# EasyEDA Pro project pcb_main.epro

# Schematic Schematic1
Board Name: Board3; Create Date: 2026-03-30; Page Name: P1; Project Name: DPE25-26-2PCB; Schematic Name: Schematic1; Update Date: 2026-04-02; Company: EasyEDA.com; Page Size: A4; Version: V1.0
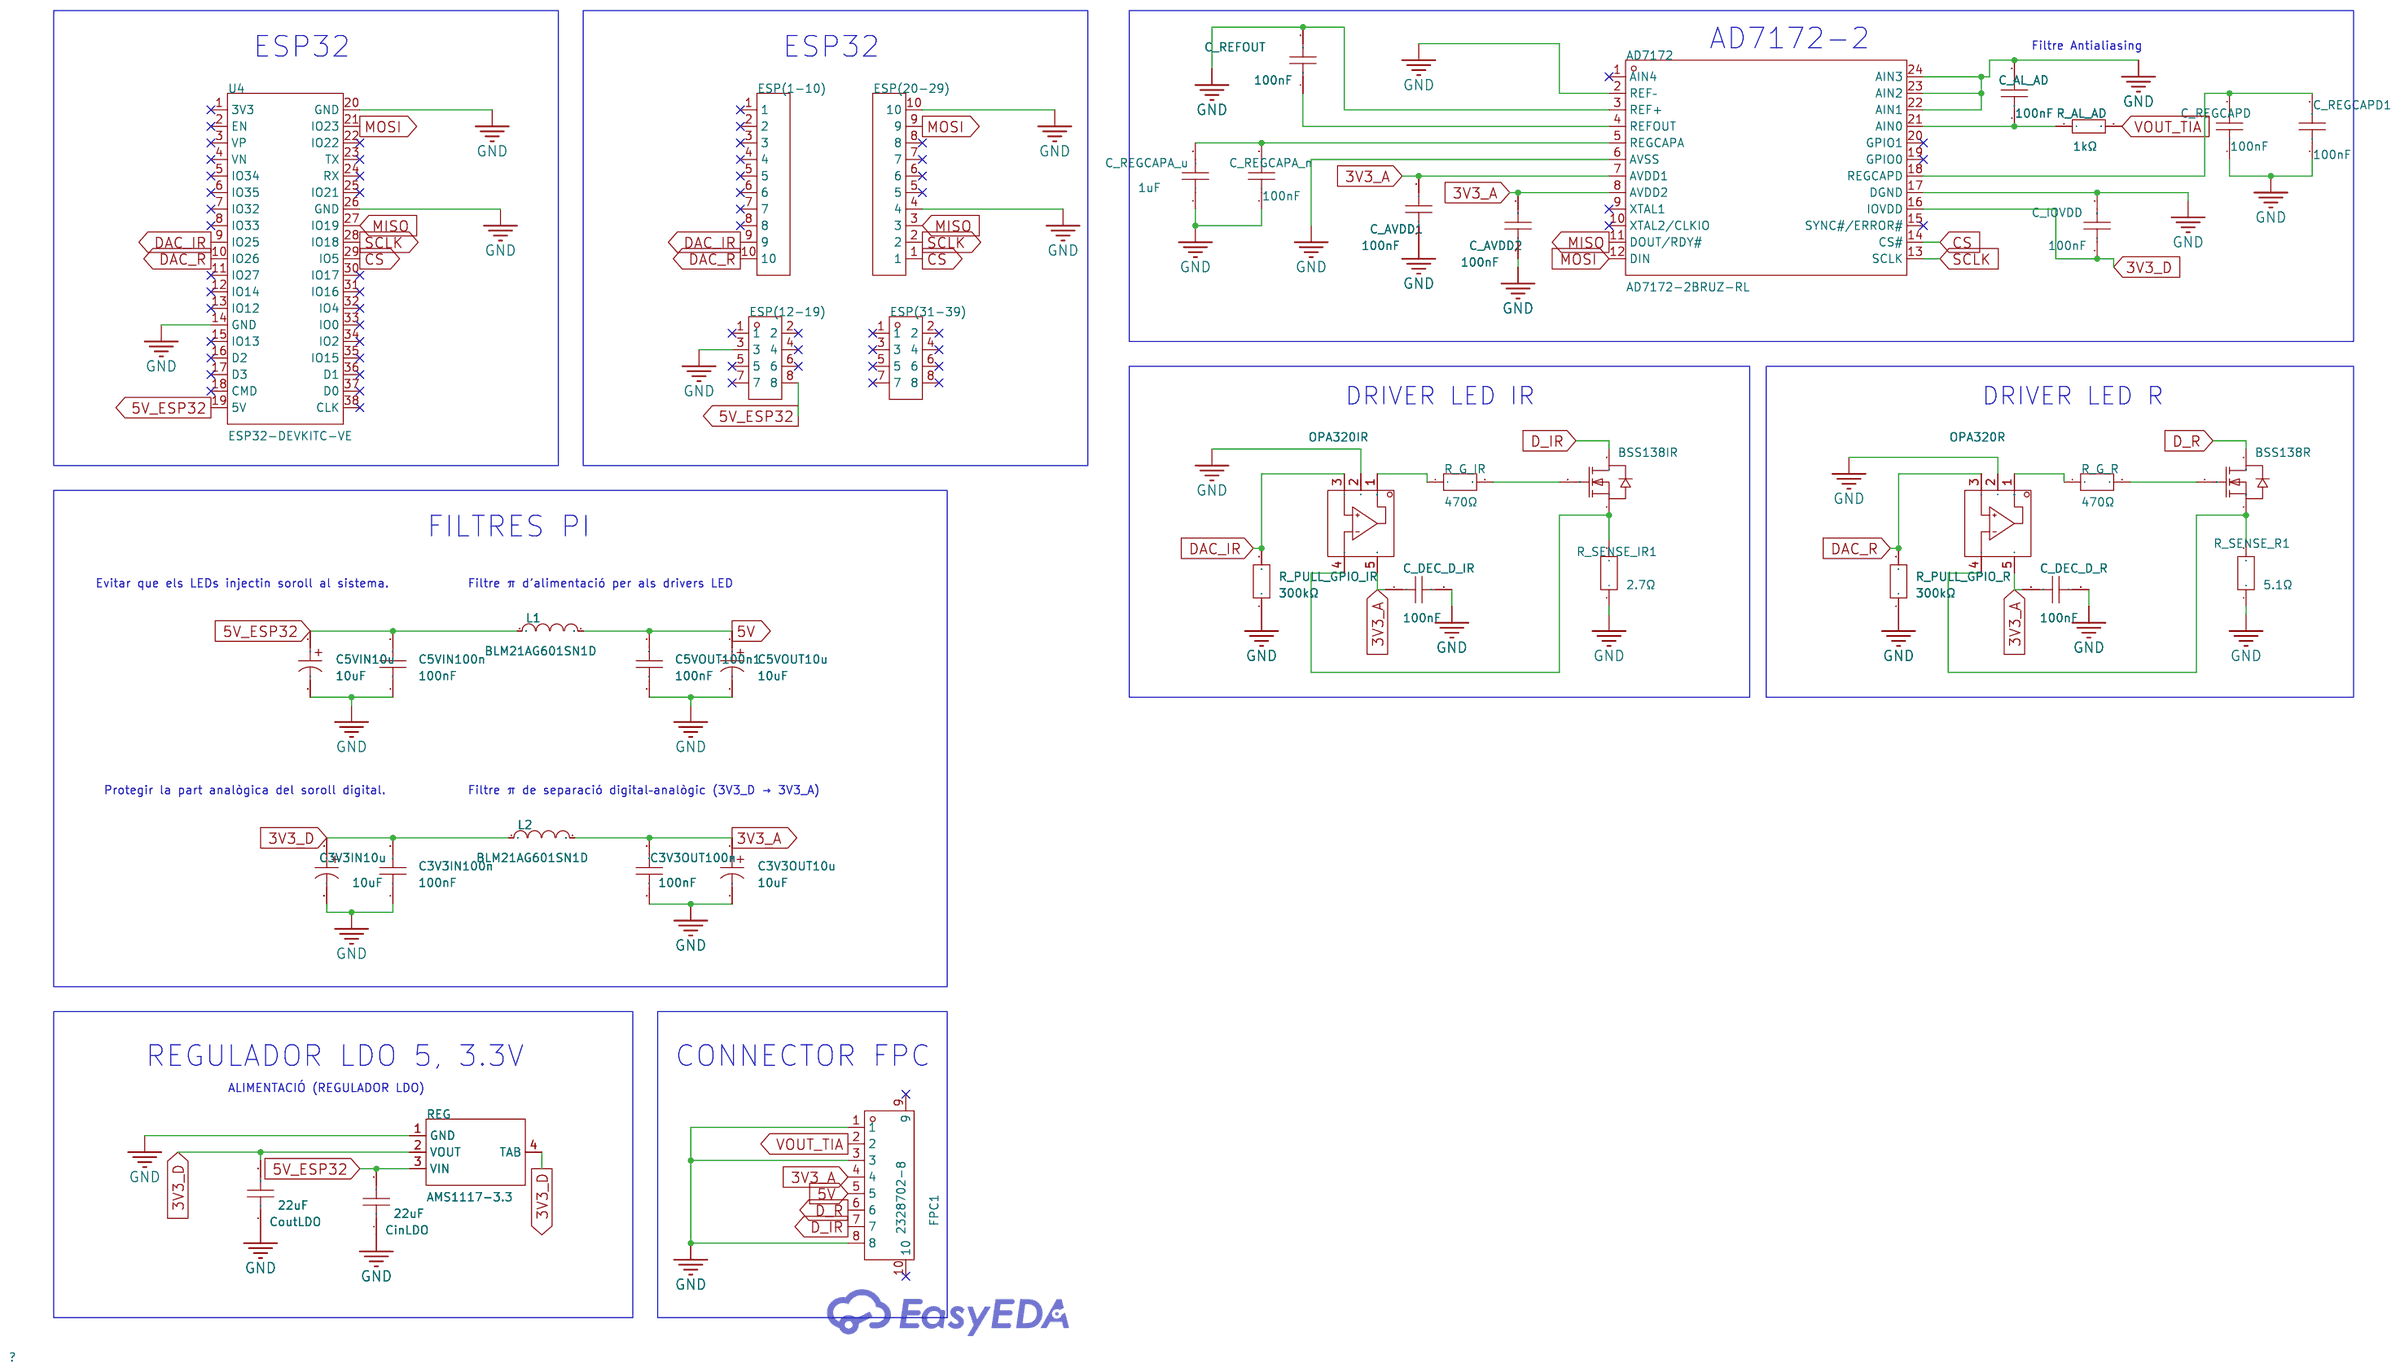
[diagram p0: schematic sheet]

## Parts
AD7172  AD7172-2BRUZ-RL  [TSSOP-24_L7.8-W4.4-P0.65-LS6.4-BL_1]
BSS138IR  BSS138IR  [SOT-23-3_L2.9-W1.3-P1.90-LS2.4-BR_1]
BSS138R  BSS138R  [SOT-23-3_L2.9-W1.3-P1.90-LS2.4-BR_1]
C3V3IN10u  10uF  [CAP-SMD_BD4.0-L4.3-W4.3-LS5.0-FD]
C3V3IN100n  100nF  [C0603]
C3V3OUT10u  10uF  [CAP-SMD_BD4.0-L4.3-W4.3-LS5.0-FD]
C3V3OUT100n  100nF  [C0603]
C5VIN10u  10uF  [CAP-SMD_BD4.0-L4.3-W4.3-LS5.0-FD]
C5VIN100n  100nF  [C0603]
C5VOUT10u  10uF  [CAP-SMD_BD4.0-L4.3-W4.3-LS5.0-FD]
C5VOUT100n1  100nF  [C0603]
C_AL_AD  100nF  [C0805]
C_AVDD1  100nF  [C0603]
C_AVDD2  100nF  [C0603]
C_DEC_D_IR  100nF  [C0603]
C_DEC_D_R  100nF  [C0603]
C_IOVDD  100nF  [C0603]
C_REFOUT  100nF  [C0603]
C_REGCAPA_n  100nF  [C0805]
C_REGCAPA_u  1uF  [C0805]
C_REGCAPD  100nF  [C0805]
C_REGCAPD1  100nF  [C0603]
CinLDO  22uF  [C0805]
CoutLDO  22uF  [C0805]
ESP(1-10)  HX PM2.54-1x10P TP-YQ  [HDR-SMD_10P-P2.54-V-F-LS4.9]
ESP(12-19)  ESP (12-19)  [HDR-SMD_8P-P2.54-V-F-LS4.9]
ESP(20-29)  HX PM2.54-1x10P TP-YQ  [HDR-SMD_10P-P2.54-V-F-LS4.9]
ESP(31-39)  HX PM2.54-1x8P TP-YQ  [HDR-SMD_8P-P2.54-V-F-LS4.9]
FPC1  2328702-8  [CONN-SMD_8P-P0.50-2328702-8]
L1  BLM21AG601SN1D  [L0805]
L2  BLM21AG601SN1D  [L0805]
OPA320_D_IR1  OPA320IR  [SOT-23-5_L2.9-W1.6-P0.95-LS2.8-BL]
OPA320_D_R1  OPA320R  [SOT-23-5_L2.9-W1.6-P0.95-LS2.8-BL]
R_AL_AD  1kΩ  [R0603]
R_G_IR  470Ω  [R0603]
R_G_R  470Ω  [R0603]
R_PULL_GPIO_IR  300kΩ  [R0603]
R_PULL_GPIO_R  300kΩ  [R0603]
R_SENSE_IR1  2.7Ω  [R0805]
R_SENSE_R1  5.1Ω  [R0805]
REG  AMS1117-3.3  [SOT-223-3_L6.5-W3.5-P3.05-LS7.0]
U4  ESP32-DEVKITC-VE  [BULETM-SMD_ESP32-DEVKITC]  (no BOM)

## Library data of the parts
AD7172 = AD7172-2BRUZ-RL: Resolution(Bits):24 Sampling Rate:31.25kHz number of channels:2 Voltage - Supply:3V~5.5V Voltage - Supply:3V~5.5V Interface:SPI differential input:Yes Integral non - linearity:- Integral non - linearity:- Operating Temperature:-40℃~+105℃ Operating Tempera; LCSC Part Name: 低功耗、24位、31.25 kSPS、Σ-Δ ADC; Supplier Part: C650613; Manufacturer: ADI(亚德诺); Supplier Footprint: TSSOP-24; JLCPCB Part Class: Extended Part; Datasheet: https://item.szlcsc.com/datasheet/AD7172-2BRUZ-RL/680222.html; Supplier: LCSC; Resolution(Bits): 24; Sampling Rate: 31.25kHz; number of channels: 2; Voltage - Supply: 3V~5.5V; Interface: SPI; differential input: Yes; Operating Temperature: -40℃~+105℃; Clock/Oscillator: Built-in；External; Clock Frequency: 2MHz；2MHz~2.048MHz; Voltage Reference: Built-in; Voltage Reference Drift: 2ppm/℃; Programmable Gain: Support; Temperature Sensors: Built-in; ADC architecture: Sigma-Delta; Data rate: 31.25kHz; Quiescent Current (Iq): 1uA
BSS138IR BSS138R = BSS138_C51898309: LCSC Part Name: BSS138; Supplier Part: C51898309; Manufacturer: baocheng(宝乘); Supplier Footprint: SOT-23; JLCPCB Part Class: Extended Part; Datasheet: https://item.szlcsc.com/datasheet/BSS138/54583734.html; Supplier: LCSC
C3V3IN10u C3V3OUT10u C5VIN10u C5VOUT10u = RST10UF35V015: Capacitance:10uF Tolerance:±20% Tolerance:±20% Voltage Rating:35V Ripple Current:15mA@120Hz Equivalent Series Resistance(ESR):- Diameter:4mm Height - Seated (Max):5.4mm Lifetime:2000hrs@105℃ Operating Temperature:-40℃~+105℃ Operating Temperature:-40℃~+105; LCSC Part Name: 10uF ±20% 35V; Supplier Part: C4747970; Manufacturer: KNSCHA(科尼盛); Supplier Footprint: SMD,D4xL5.4mm; JLCPCB Part Class: Extended Part; Datasheet: https://item.szlcsc.com/datasheet/RST10UF35V015/5320097.html; Supplier: LCSC; Tolerance: ±20%; Voltage Rating: 35V; Ripple Current: 15mA@120Hz; Diameter: 4mm; Height - Seated (Max): 5.4mm; Lifetime: 2000hrs@105℃; Operating Temperature: -40℃~+105℃
C3V3IN100n C3V3OUT100n C5VIN100n C5VOUT100n1 C_AVDD1 C_AVDD2 C_DEC_D_IR C_DEC_D_R C_IOVDD C_REFOUT C_REGCAPD1 = 0603Y0160104JDR: Capacitance:100nF Tolerance:±5% Tolerance:±5% Voltage Rating:16V Temperature Coefficient:-; LCSC Part Name: 100nF ±5% 16V; Supplier Part: C2311333; Manufacturer: Knowles(楼氏); Supplier Footprint: 0603; JLCPCB Part Class: Extended Part; Datasheet: https://item.szlcsc.com/datasheet/0603Y0160104JDR/2403428.html; Supplier: LCSC; Tolerance: ±5%; Voltage Rating: 16V
C_AL_AD C_REGCAPA_n C_REGCAPD = C0805X104K101TB: Capacitance:100nF Tolerance:±10% Tolerance:±10% Voltage Rating:100V Temperature Coefficient:-; LCSC Part Name: 100nF ±10% 100V; Supplier Part: C495959; Manufacturer: IHHEC(禾伸堂); Supplier Footprint: 0805; JLCPCB Part Class: Extended Part; Datasheet: https://item.szlcsc.com/datasheet/C0805X104K101TB/507439.html; Supplier: LCSC; Tolerance: ±10%; Voltage Rating: 100V
C_REGCAPA_u = NC0805B105K101CDDN: Capacitance:1uF Tolerance:±10% Tolerance:±10% Voltage Rating:100V; LCSC Part Name: 1uF ±10% 100V; Supplier Part: C19185643; Manufacturer: HUI JU(汇聚); Supplier Footprint: 0805; JLCPCB Part Class: Extended Part; Datasheet: https://item.szlcsc.com/datasheet/NC0805B105K101CDDN/20402342.html; Supplier: LCSC; Tolerance: ±10%; Voltage Rating: 100V
CinLDO CoutLDO = V226M0805X5R100NHP: Capacitance:22uF Voltage Rating:10V Temperature Coefficient:X5R; LCSC Part Name: 22uF 10V; Supplier Part: C4749141; Manufacturer: VIIYONG(微容); Supplier Footprint: 0805; JLCPCB Part Class: Extended Part; Datasheet: https://item.szlcsc.com/datasheet/V226M0805X5R100NHP/5321986.html; Supplier: LCSC; Voltage Rating: 10V; Temperature Coefficient: X5R
ESP(1-10) ESP(20-29) = HX PM2.54-1x10P TP-YQ: Holes Structure:1x10P Pitch:2.54mm Row Spacing:- Circular Hole / Square Hole:Square Hole Mounting Type:Surface Mount,Vertical Number of Rows:1 Number of Positions:10P Current Rating:3A Voltage Rating (Max):1kV Holes Direction:Top Insulation Height:5mm Con; LCSC Part Name: 1x10P 间距:2.54mm 立贴; Supplier Part: C42379201; Manufacturer: hanxia(韩下); Supplier Footprint: SMD,P=2.54mm(交错脚); JLCPCB Part Class: Extended Part; Datasheet: https://item.szlcsc.com/datasheet/HX%2520PM2.54-1x10P%2520TP-YQ/44285230.html; Supplier: LCSC; Holes Structure: 1x10P; Pitch: 2.54mm; Circular Hole / Square Hole: Square Hole; Mounting Type: Surface Mount,Vertical; Number of Rows: 1; Number of Positions: 10P; Current Rating: 3A; Voltage Rating (Max): 1kV; Holes Direction: Top; Insulation Height: 5mm; Contact Material: Brass; Contact Plating: Gold; Operating Temperature: -40℃~+105℃
ESP(12-19) ESP(31-39) = HX PM2.54-1x8P TP-YQ: Holes Structure:1x8P Pitch:2.54mm Row Spacing:- Circular Hole / Square Hole:Square Hole Mounting Type:Surface Mount,Vertical Number of Rows:1 Number of Positions:8P Current Rating:3A Voltage Rating (Max):1kV Holes Direction:Top Insulation Height:5mm Conta; LCSC Part Name: 1x8P 间距:2.54mm 立贴; Supplier Part: C42380985; Manufacturer: hanxia(韩下); Supplier Footprint: SMD,P=2.54mm(交错脚); JLCPCB Part Class: Extended Part; Datasheet: https://item.szlcsc.com/datasheet/HX%2520PM2.54-1x8P%2520TP-YQ/44294349.html; Supplier: LCSC; Holes Structure: 1x8P; Pitch: 2.54mm; Circular Hole / Square Hole: Square Hole; Mounting Type: Surface Mount,Vertical; Number of Rows: 1; Number of Positions: 8P; Current Rating: 3A; Voltage Rating (Max): 1kV; Holes Direction: Top; Insulation Height: 5mm; Contact Material: Brass; Contact Plating: Gold; Operating Temperature: -40℃~+105℃
FPC1 = 2328702-8: Locking Feature:Hinged Lid Contact Type:Double-Sided Contacts, Top and Bottom Entry Number of Contacts:8P Pitch:0.5mm Mounting Type:Surface Mount, Right Angle FFC, FCB Thickness:0.3mm FFC, FCB Thickness:0.3mm Height Above Board:1.05mm Contact Material:Cop; LCSC Part Name: 翻盖式 双侧触点/上下接 P数:8P 间距:0.5mm; Supplier Part: C3168593; Manufacturer: TE Connectivity(泰科电子); Supplier Footprint: SMD,P=0.5mm,卧贴; JLCPCB Part Class: Extended Part; Datasheet: https://item.szlcsc.com/datasheet/2328702-8/3730530.html; Supplier: LCSC; Locking Feature: Hinged Lid; Contact Type: Double-Sided Contacts, Top and Bottom Entry; Number of Contacts: 8P; Pitch: 0.5mm; Mounting Type: Surface Mount, Right Angle; FFC, FCB Thickness: 0.3mm; Height Above Board: 1.05mm; Contact Material: Copper Alloy; Contact Plating: Gold; Operating Temperature: -40℃~+85℃; Rated Voltage (Max): 50V; Current Rating (Max): 500mA
L1 L2 = BLM21AG601SN1D: Impedance @ Frequency:600Ω@100MHz Tolerance:±25% Tolerance:±25% DC Resistance(DCR):210mΩ Current Rating:700mA Number of Circuits:1 Operating Temperature:-55℃~+125℃ Operating Temperature:-55℃~+125℃; LCSC Part Name: 单路 0805磁珠 阻抗600Ω@100MHz; Supplier Part: C85837; Manufacturer: muRata(村田); Supplier Footprint: 0805; JLCPCB Part Class: Extended Part; Datasheet: https://item.szlcsc.com/datasheet/BLM21AG601SN1D/87013.html; Supplier: LCSC; Impedance @ Frequency: 600Ω@100MHz; Tolerance: ±25%; DC Resistance(DCR): 210mΩ; Current Rating: 700mA; Number of Circuits: 1; Operating Temperature: -55℃~+125℃
OPA320_D_IR1 OPA320_D_R1 = OPA320AIDBVT: Number of Channels:Single channel Gain Bandwidth Product:20MHz Ib - Input Bias Current:0.2pA Slew Rate:10V/us Output Current:65mA Output Type:- Rail to Rail:- Operating Temperature:-40℃~+125℃ Operating Temperature:-40℃~+125℃; Supplier Part: C206063; Manufacturer: TI(德州仪器); Supplier Footprint: SOT-23-5; JLCPCB Part Class: Extended Part; Datasheet: https://www.ti.com/cn/lit/gpn/opa320; Supplier: LCSC; Number of Channels: Single channel; Gain Bandwidth Product: 20MHz; Ib - Input Bias Current: 0.2pA; Slew Rate: 10V/us; Output Current: 65mA; Operating Temperature: -40℃~+125℃
R_AL_AD = RC0603FR-071KL: Type:Thick Film Resistor Resistance:1kΩ Tolerance:±1% Tolerance:±1% Power(Watts):100mW Voltage-Supply(Max):75V Temperature Coefficient:±100ppm/℃ Temperature Coefficient:±100ppm/℃ Operating Temperature:-55℃~+155℃ Operating Temperature:-55℃~+155℃; LCSC Part Name: 厚膜电阻 1kΩ ±1% 100mW; Supplier Part: C22548; Manufacturer: YAGEO(国巨); Supplier Footprint: 0603; JLCPCB Part Class: Extended Part; Datasheet: https://item.szlcsc.com/datasheet/RC0603FR-071KL/23274.html; Supplier: LCSC; Type: Thick Film Resistor; Tolerance: ±1%; Power(Watts): 100mW; Voltage-Supply(Max): 75V; Temperature Coefficient: ±100ppm/℃; Operating Temperature: -55℃~+155℃
R_G_IR R_G_R = CR0603F470RP05Z: Type:Thick Film Resistor Resistance:470Ω Tolerance:±1% Tolerance:±1% Power(Watts):100mW Voltage-Supply(Max):75V Temperature Coefficient:±100ppm/℃ Temperature Coefficient:±100ppm/℃ Operating Temperature:-55℃~+155℃ Operating Temperature:-55℃~+155℃; LCSC Part Name: 厚膜电阻 470Ω ±1% 100mW; Supplier Part: C881392; Manufacturer: EVER OHMS(天二科技); Supplier Footprint: 0603; JLCPCB Part Class: Extended Part; Datasheet: https://item.szlcsc.com/datasheet/CR0603F470RP05Z/944307.html; Supplier: LCSC; Type: Thick Film Resistor; Tolerance: ±1%; Power(Watts): 100mW; Voltage-Supply(Max): 75V; Temperature Coefficient: ±100ppm/℃; Operating Temperature: -55℃~+155℃
R_PULL_GPIO_IR R_PULL_GPIO_R = CR0603F300KP05Z: Type:Thick Film Resistor Resistance:300kΩ Tolerance:±1% Tolerance:±1% Power(Watts):100mW Voltage-Supply(Max):75V Temperature Coefficient:±100ppm/℃ Temperature Coefficient:±100ppm/℃ Operating Temperature:-55℃~+155℃ Operating Temperature:-55℃~+155℃; LCSC Part Name: 厚膜电阻 300kΩ ±1% 100mW; Supplier Part: C881030; Manufacturer: EVER OHMS(天二科技); Supplier Footprint: 0603; JLCPCB Part Class: Extended Part; Datasheet: https://item.szlcsc.com/datasheet/CR0603F300KP05Z/943945.html; Supplier: LCSC; Type: Thick Film Resistor; Tolerance: ±1%; Power(Watts): 100mW; Voltage-Supply(Max): 75V; Temperature Coefficient: ±100ppm/℃; Operating Temperature: -55℃~+155℃
R_SENSE_IR1 = CR0805F2R70P05S: Type:Thick Film Resistor Resistance:2.7Ω Tolerance:±1% Tolerance:±1% Power(Watts):125mW Voltage-Supply(Max):150V Temperature Coefficient:±400ppm/℃ Temperature Coefficient:±400ppm/℃ Operating Temperature:-55℃~+155℃ Operating Temperature:-55℃~+155℃; LCSC Part Name: 厚膜电阻 2.7Ω ±1% 125mW; Supplier Part: C781998; Manufacturer: EVER OHMS(天二科技); Supplier Footprint: 0805; JLCPCB Part Class: Extended Part; Datasheet: https://item.szlcsc.com/datasheet/CR0805F2R70P05S/834811.html; Supplier: LCSC; Type: Thick Film Resistor; Tolerance: ±1%; Power(Watts): 125mW; Voltage-Supply(Max): 150V; Temperature Coefficient: ±400ppm/℃; Operating Temperature: -55℃~+155℃
R_SENSE_R1 = FRC0805F5R10TS: Type:Thick Film Resistor Resistance:5.1Ω Tolerance:±1% Tolerance:±1% Power(Watts):125mW Voltage-Supply(Max):150V Temperature Coefficient:±200ppm/℃ Temperature Coefficient:±200ppm/℃ Operating Temperature:-55℃~+155℃ Operating Temperature:-55℃~+155℃; LCSC Part Name: 5.1Ω ±1% 125mW 厚膜电阻; Supplier Part: C2907270; Manufacturer: FOJAN(富捷); Supplier Footprint: 0805; JLCPCB Part Class: Extended Part; Supplier: LCSC; Type: Thick Film Resistor; Tolerance: ±1%; Power(Watts): 125mW; Voltage-Supply(Max): 150V; Temperature Coefficient: ±200ppm/℃; Operating Temperature: -55℃~+155℃
REG = AMS1117-3.3_C5250992: Output Type:Fixed Voltage - Supply:12V Output Voltage:3.3V Output Voltage:3.3V Output Current:1A Power Supply Rejection Ratio (PSRR):70dB@(120Hz) Voltage Dropout:1.4V@(1A) standby current:3mA Noise:0.003%Vout Features:Over Temperature Protection Operating; LCSC Part Name: 3.3V 1A 12V; Supplier Part: C5250992; Manufacturer: TWGMC(迪嘉); Supplier Footprint: SOT-223-3L; JLCPCB Part Class: Extended Part; Datasheet: https://item.szlcsc.com/datasheet/AMS1117-3.3/5967328.html; Supplier: LCSC; Output Type: Fixed; Voltage - Supply: 12V; Output Voltage: 3.3V; Output Current: 1A; Power Supply Rejection Ratio (PSRR): 70dB@(120Hz); Voltage Dropout: 1.4V@(1A); standby current: 3mA; Noise: 0.003%Vout; Features: Over Temperature Protection; Operating Temperature: -40℃~+125℃@(Tj); Output Configuration: Positive; Number of Outputs: 1
U4 = ESP32-DEVKITC-VE: Supplier Part: C20437001; Manufacturer: ESPRESSIF(乐鑫); JLCPCB Part Class: Extended Part; Datasheet: https://item.szlcsc.com/datasheet/ESP32-DEVKITC-VE/21775466.html; Supplier: LCSC

## Nets
3V3_A: AD7172.7(AVDD1) AD7172.8(AVDD2) C3V3OUT10u.1 C3V3OUT100n.2 C_AVDD1.2 C_AVDD2.2 C_DEC_D_IR.1 C_DEC_D_R.1 FPC1.4 L2.2 OPA320_D_IR1.5(V+) OPA320_D_R1.5(V+)
3V3_D: AD7172.16(IOVDD) C3V3IN10u.1 C3V3IN100n.2 C_IOVDD.1 CoutLDO.2 L2.1 REG.2(VOUT) REG.4(TAB)
5V: C5VOUT10u.1 C5VOUT100n1.2 FPC1.5 L1.2
5V_ESP32: C5VIN10u.1 C5VIN100n.2 CinLDO.2 ESP(12-19).8 L1.1 REG.3(VIN) U4.19(5V)
GND: AD7172.2(REF–) AD7172.3(REF+) AD7172.6(AVSS) AD7172.17(DGND) AD7172.22(AIN1) AD7172.23(AIN2) AD7172.24(AIN3) C3V3IN10u.2 C3V3IN100n.1 C3V3OUT10u.2 C3V3OUT100n.1 C5VIN10u.2 C5VIN100n.1 C5VOUT10u.2 C5VOUT100n1.1 C_AL_AD.2 C_AVDD1.1 C_AVDD2.1 C_DEC_D_IR.2 C_DEC_D_R.2 C_IOVDD.2 C_REFOUT.2 C_REGCAPA_n.1 C_REGCAPA_u.1 C_REGCAPD.1 C_REGCAPD1.1 CinLDO.1 CoutLDO.1 ESP(12-19).3 ESP(20-29).4 ESP(20-29).10 FPC1.1 FPC1.3 FPC1.8 OPA320_D_IR1.2(V-) OPA320_D_R1.2(V-) R_PULL_GPIO_IR.1 R_PULL_GPIO_R.1 R_SENSE_IR1.1 R_SENSE_R1.1 REG.1(GND) U4.14(GND) U4.20(GND) U4.26(GND)
CS: AD7172.14(CS#) ESP(20-29).1 U4.29(IO5)
D_IR: BSS138IR.3(D) FPC1.7
D_R: BSS138R.3(D) FPC1.6
DAC_IR: ESP(1-10).9 OPA320_D_IR1.3(IN+) R_PULL_GPIO_IR.2 U4.9(IO25)
DAC_R: ESP(1-10).10 OPA320_D_R1.3(IN+) R_PULL_GPIO_R.2 U4.10(IO26)
MISO: AD7172.11(DOUT/RDY#) ESP(20-29).3 U4.27(IO19)
MOSI: AD7172.12(DIN) ESP(20-29).9 U4.21(IO23)
SCLK: AD7172.13(SCLK) ESP(20-29).2 U4.28(IO18)
VOUT_TIA: FPC1.2 R_AL_AD.2
$1N2727: AD7172.5(REGCAPA) C_REGCAPA_n.2 C_REGCAPA_u.2
$1N2737: AD7172.4(REFOUT) C_REFOUT.1
$1N2746: AD7172.21(AIN0) C_AL_AD.1 R_AL_AD.1
$1N2760: BSS138R.2(S) OPA320_D_R1.4(IN-) R_SENSE_R1.2
$1N2763: BSS138R.1(G) R_G_R.2
$1N2768: BSS138IR.2(S) OPA320_D_IR1.4(IN-) R_SENSE_IR1.2
$1N2770: BSS138IR.1(G) R_G_IR.2
$1N2775: OPA320_D_R1.1(OUT) R_G_R.1
$1N2776: OPA320_D_IR1.1(OUT) R_G_IR.1
$1N2779: AD7172.18(REGCAPD) C_REGCAPD.2 C_REGCAPD1.2

Not connected (* = marked no-connect by the designer): AD7172 1(AIN4)* 9(XTAL1)* 10(XTAL2/CLKIO)* 15(SYNC#/ERROR#)* 19(GPIO0)* 20(GPIO1)*; ESP(1-10) 1* 2* 3* 4* 5* 6* 7* 8*; ESP(12-19) 1* 2* 4* 5* 6* 7*; ESP(20-29) 5* 6* 7* 8*; ESP(31-39) 1* 2* 3* 4* 5* 6* 7* 8*; FPC1 9* 10*; U4 1(3V3)* 2(EN)* 3(VP)* 4(VN)* 5(IO34)* 6(IO35)* 7(IO32)* 8(IO33)* 11(IO27)* 12(IO14)* 13(IO12)* 15(IO13)* 16(D2)* 17(D3)* 18(CMD)* 22(IO22)* 23(TX)* 24(RX)* 25(IO21)* 30(IO17)* 31(IO16)* 32(IO4)* 33(IO0)* 34(IO2)* 35(IO15)* 36(D1)* 37(D0)* 38(CLK)*

## Notes on the sheet
- AD7172-2
- Filtre Antialiasing
- ESP32
- ESP32
- DRIVER LED IR
- DRIVER LED R
- FILTRES PI
- Evitar que els LEDs injectin soroll al sistema.
- Filtre π d’alimentació per als drivers LED
- Protegir la part analògica del soroll digital.
- Filtre π de separació digital–analògic (3V3_D → 3V3_A)
- REGULADOR LDO 5, 3.3V
- CONNECTOR FPC
- ALIMENTACIÓ (REGULADOR LDO)

# Board PCB11
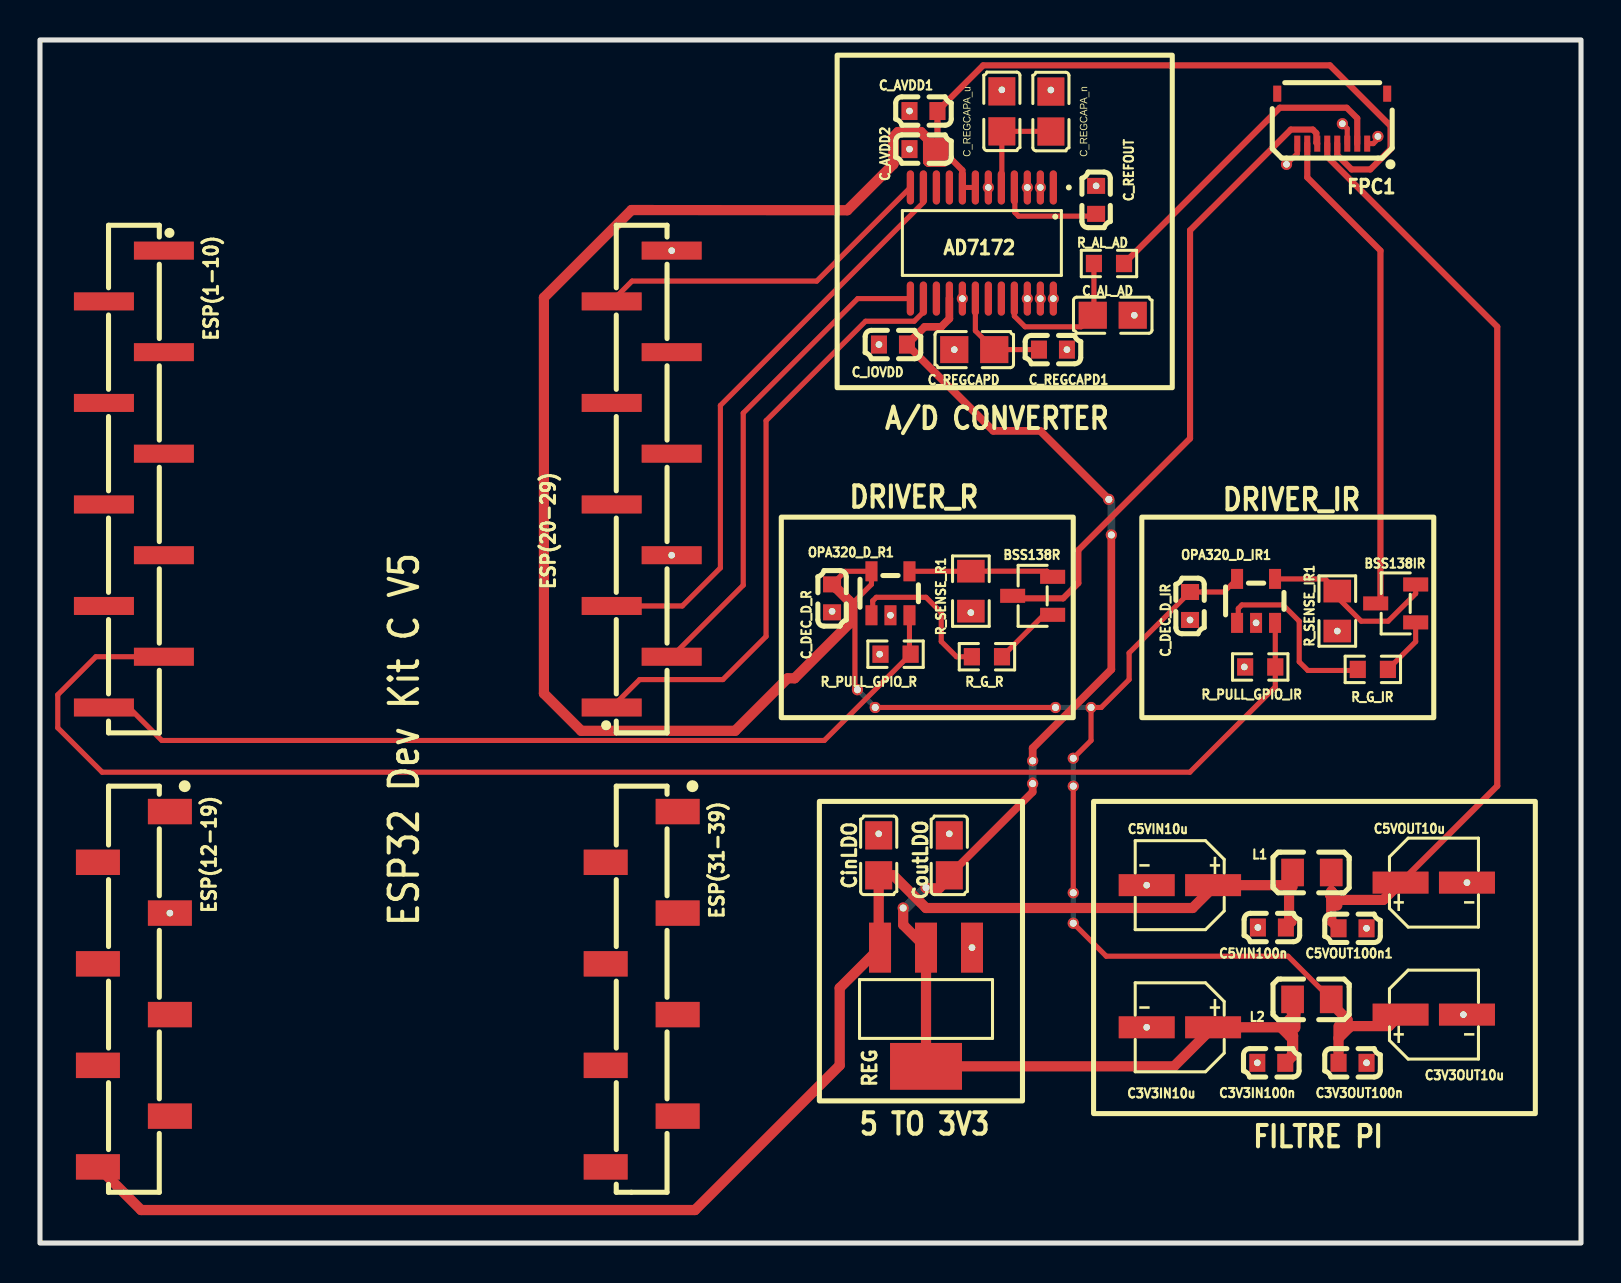
[diagram p1: board, top side]
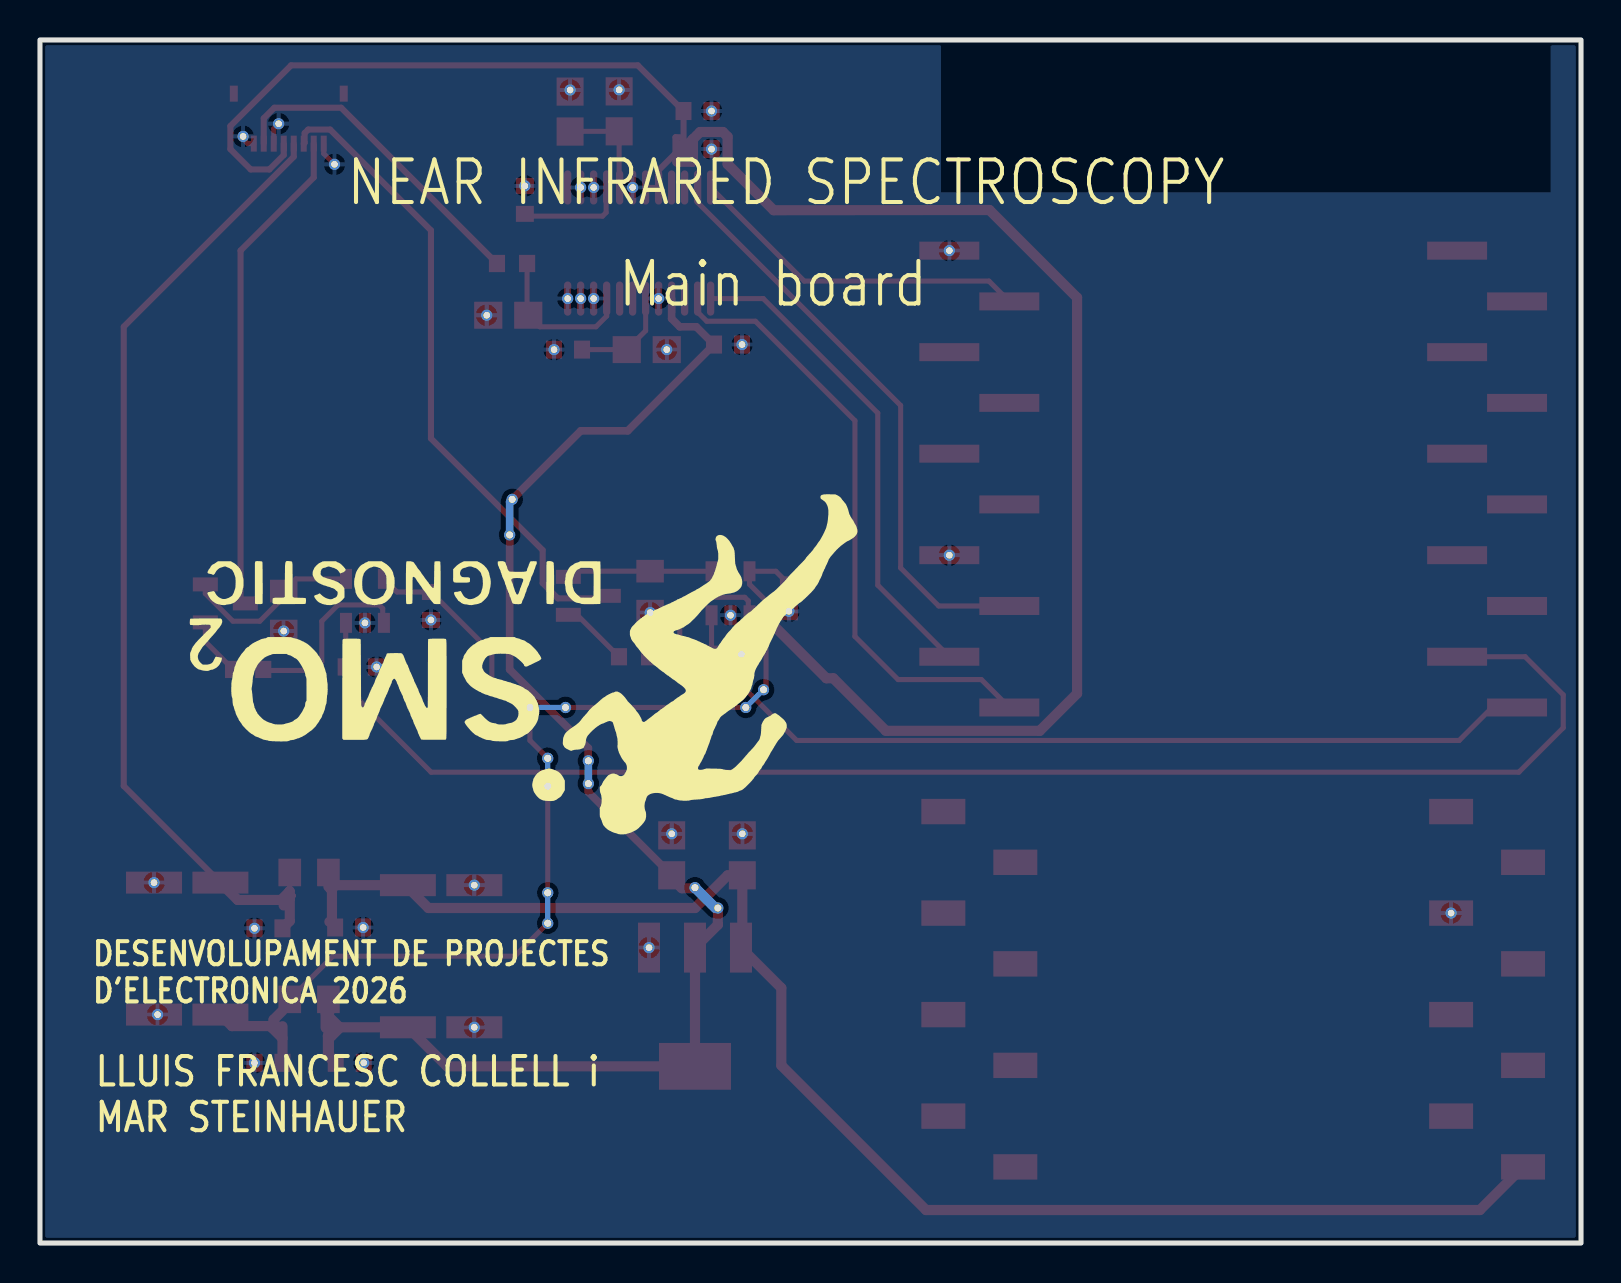
[diagram p2: board, bottom side, seen from below]

Outline 77.09 x 60.2 mm; copper layers: Top Layer, Bottom Layer. Coordinates in mm from the lower left corner of the outline.
Outline path: rectangle 0,60.2 77.09,0
Stack: Top Layer 0.035mm / Dielectric1 1.51mm FR4 er 4.5 / Bottom Layer 0.035mm

## Design rules (mm)
template: Custom Config
spacing copperThickness1oz (default): track to track 0.102, other pairs 0.152 to 0.3
spacing copperThickness2oz: track to track 0.203, other pairs 0.152 to 0.3
track width copperThickness1oz (default): min 0.127, default 0.254, max 2.54
track width copperThickness2oz: min 0.203, default 0.254, max 2.54
differential pair differentialPair (default): width min 0.127, default 0.254, max 2.54; gap min 0.152, default 0.152
via viaSize (default): diameter min 0.5, default 0.61, max 10; hole min 0.3, default 0.305, max 6.3

## Placement (name value [footprint] x y rotation side)
AD7172  AD7172-2BRUZ-RL  [TSSOP-24_L7.8-W4.4-P0.65-LS6.4-BL_1]  47.12 50.04 180 top
BSS138IR  BSS138IR  [SOT-23-3_L2.9-W1.3-P1.90-LS2.4-BR_1]  67.82 32 0 top
BSS138R  BSS138R  [SOT-23-3_L2.9-W1.3-P1.90-LS2.4-BR_1]  49.66 32.38 0 top
C3V3IN10u  10uF  [CAP-SMD_BD4.0-L4.3-W4.3-LS5.0-FD]  57.02 10.79 180 top
C3V3IN100n  100nF  [C0603]  61.6 9.02 0 top
C3V3OUT10u  10uF  [CAP-SMD_BD4.0-L4.3-W4.3-LS5.0-FD]  69.72 11.43 0 top
C3V3OUT100n  100nF  [C0603]  65.66 9.02 180 top
C5VIN10u  10uF  [CAP-SMD_BD4.0-L4.3-W4.3-LS5.0-FD]  57.02 17.91 180 top
C5VIN100n  100nF  [C0603]  61.63 15.79 0 top
C5VOUT10u  10uF  [CAP-SMD_BD4.0-L4.3-W4.3-LS5.0-FD]  69.72 18.03 0 top
C5VOUT100n1  100nF  [C0603]  65.66 15.75 180 top
C_AL_AD  100nF  [C0805]  53.66 46.42 0 top
C_AVDD1  100nF  [C0603]  44.2 56.64 0 top
C_AVDD2  100nF  [C0603]  44.2 54.74 0 top
C_DEC_D_IR  100nF  [C0603]  57.53 31.88 270 top
C_DEC_D_R  100nF  [C0603]  39.62 32.26 270 top
C_IOVDD  100nF  [C0603]  42.67 44.96 180 top
C_REFOUT  100nF  [C0603]  52.83 52.2 90 top
C_REGCAPA_n  100nF  [C0805]  50.57 56.62 270 top
C_REGCAPA_u  1uF  [C0805]  48.12 56.63 270 top
C_REGCAPD  100nF  [C0805]  46.74 44.7 0 top
C_REGCAPD1  100nF  [C0603]  50.67 44.7 180 top
CinLDO  22uF  [C0805]  41.96 19.4 270 top
CoutLDO  22uF  [C0805]  45.49 19.4 270 top
ESP(1-10)  HX PM2.54-1x10P TP-YQ  [HDR-SMD_10P-P2.54-V-F-LS4.9]  4.7 38.23 270 top
ESP(12-19)  ESP (12-19)  [HDR-SMD_8P-P2.54-V-F-LS4.9]  4.7 12.7 270 top
ESP(20-29)  HX PM2.54-1x10P TP-YQ  [HDR-SMD_10P-P2.54-V-F-LS4.9]  30.1 38.23 90 top
ESP(31-39)  HX PM2.54-1x8P TP-YQ  [HDR-SMD_8P-P2.54-V-F-LS4.9]  30.1 12.7 270 top
FPC1  2328702-8  [CONN-SMD_8P-P0.50-2328702-8]  64.64 56.26 180 top
L1  BLM21AG601SN1D  [L0805]  63.63 18.54 0 top
L2  BLM21AG601SN1D  [L0805]  63.63 12.19 0 top
NOREF  -  [Pad_e1363]  51.69 17.53 0 top
NOREF#2  -  [Pad_e1388]  53.47 37.21 0 top
NOREF#3  -  [Pad_e1721]  45.74 44.7 0 top
NOREF#4  -  [Pad_e1716]  47.44 52.82 0 top
NOREF#5  -  [Pad_e1724]  50.69 47.26 0 top
NOREF#6  -  [Pad_e1688]  60.25 28.82 0 top
NOREF#7  -  [Pad_e1726]  49.39 47.26 0 top
NOREF#8  -  [Pad_e1707]  65.15 56.01 0 top
NOREF#9  -  [Pad_e1414]  43.18 16.76 0 top
NOREF#10  -  [Pad_e246]  31.6 49.66 0 top
NOREF#11  -  [Pad_e1681]  60.92 15.79 0 top
NOREF#12  -  [Pad_e1742]  57.53 31.18 0 top
NOREF#13  -  [Pad_e1685]  71.21 11.43 0 top
NOREF#14  -  [Pad_e1747]  39.62 31.61 0 top
NOREF#15  -  [Pad_e1348]  41.78 26.8 0 top
NOREF#16  -  [Pad_e1694]  66.93 55.37 0 top
NOREF#17  -  [Pad_e1734]  42 29.46 0 top
NOREF#18  -  [Pad_e1686]  71.38 18.03 0 top
NOREF#19  -  [Pad_e1731]  6.5 16.51 0 top
NOREF#20  -  [Pad_e1349]  40.89 27.69 0 top
NOREF#21  -  [Pad_e1733]  45.49 20.48 0 top
NOREF#22  -  [Pad_e1735]  42.55 31.41 0 top
NOREF#23  -  [Pad_e1415]  44.32 17.78 0 top
NOREF#24  -  [Pad_e1728]  54.74 46.42 0 top
NOREF#25  -  [Pad_e1682]  60.89 9.02 0 top
NOREF#26  -  [Pad_e1684]  55.36 10.79 0 top
NOREF#27  -  [Pad_e1746]  46.57 31.55 0 top
NOREF#28  -  [Pad_e1677]  46.62 14.78 0 top
NOREF#29  -  [Pad_e1365]  51.69 24.26 0 top
NOREF#30  -  [Pad_e1345]  50.8 26.8 0 top
NOREF#31  -  [Pad_e1718]  43.5 56.64 0 top
NOREF#32  -  [Pad_e1745]  64.9 30.62 0 top
NOREF#33  -  [Pad_e1722]  41.97 44.96 0 top
NOREF#34  -  [Pad_e245]  31.6 34.42 0 top
NOREF#35  -  [Pad_e1364]  51.69 22.86 0 top
NOREF#36  -  [Pad_e1687]  60.83 31.03 0 top
NOREF#37  -  [Pad_e1680]  55.36 17.91 0 top
NOREF#38  -  [Pad_e1725]  50.04 47.26 0 top
NOREF#39  -  [Pad_e1711]  62.36 53.97 0 top
NOREF#40  -  [Pad_e1713]  50.04 52.82 0 top
NOREF#41  -  [Pad_e1362]  51.69 16 0 top
NOREF#42  -  [Pad_e1387]  53.59 35.43 0 top
NOREF#43  -  [Pad_e1717]  43.5 54.74 0 top
NOREF#44  -  [Pad_e1732]  41.96 20.48 0 top
NOREF#45  -  [Pad_e1714]  49.39 52.82 0 top
NOREF#46  -  [Pad_e1719]  48.12 57.7 0 top
NOREF#47  -  [Pad_e1720]  50.57 57.69 0 top
NOREF#48  -  [Pad_e1727]  51.37 44.7 0 top
NOREF#49  -  [Pad_e1335]  52.58 26.8 0 top
NOREF#50  -  [Pad_e1712]  52.83 52.9 0 top
NOREF#51  -  [Pad_e1723]  46.14 47.26 0 top
NOREF#52  -  [Pad_e1382]  49.66 24.13 0 top
NOREF#53  -  [Pad_e1379]  49.66 22.99 0 top
NOREF#54  -  [Pad_e1683]  66.36 9.02 0 top
NOREF#55  -  [Pad_e1736]  66.36 15.75 0 top
OPA320_D_IR1  OPA320IR  [SOT-23-5_L2.9-W1.6-P0.95-LS2.8-BL]  60.83 32.13 0 top
OPA320_D_R1  OPA320R  [SOT-23-5_L2.9-W1.6-P0.95-LS2.8-BL]  42.55 32.51 0 top
R_AL_AD  1kΩ  [R0603]  53.48 49.01 0 top
R_G_IR  470Ω  [R0603]  66.67 28.7 0 top
R_G_R  470Ω  [R0603]  47.37 29.34 0 top
R_PULL_GPIO_IR  300kΩ  [R0603]  61.04 28.82 0 top
R_PULL_GPIO_R  300kΩ  [R0603]  42.8 29.46 0 top
R_SENSE_IR1  2.7Ω  [R0805]  64.9 31.62 90 top
R_SENSE_R1  5.1Ω  [R0805]  46.57 32.62 90 top
REG  AMS1117-3.3  [SOT-223-3_L6.5-W3.5-P3.05-LS7.0]  44.32 11.81 90 top

## Footprints (pads in the part's own frame, mm; a bottom-side part is the same pattern mirrored in y, then rotated)
C0603
  rect 0.8x0.9 smd: 1(-0.7,0) 2(0.7,0)
C0805
  rect 1.41x1.35 smd: 1(-1,0) 2(1,0)
CAP-SMD_BD4.0-L4.3-W4.3-LS5.0-FD
  rect 2.8x1.1 smd: 1(-1.661,0) 2(1.661,0)
CONN-SMD_8P-P0.50-2328702-8
  rect 0.3x0.8 smd: 1(-1.75,1.249) 2(-1.252,1.25) 3(-0.752,1.25) 4(-0.252,1.25) 5(0.248,1.25) 6(0.748,1.25) 7(1.248,1.25) 8(1.748,1.25)
  rect 0.4x0.8 smd: 9(-2.75,-1.25) 10(2.75,-1.25)
HDR-SMD_8P-P2.54-V-F-LS4.9
  rect 1.27x2.2 smd: 1(-8.89,1.8) 2(-6.35,-1.8) 3(-3.81,1.8) 4(-1.27,-1.8) 5(1.27,1.8) 6(3.81,-1.8) 7(6.35,1.8) 8(8.89,-1.8)
HDR-SMD_10P-P2.54-V-F-LS4.9
  rect 0.9x3 smd: 1(-11.43,1.5) 2(-8.89,-1.5) 3(-6.35,1.5) 4(-3.81,-1.5) 5(-1.27,1.5) 6(1.27,-1.5) 7(3.81,1.5) 8(6.35,-1.5) 9(8.89,1.5) 10(11.43,-1.5)
L0805
  rect 1.133x1.377 smd: 1(-0.966,0) 2(0.966,0)
Pad_e245
  round 0.559 hole 0.336: 3(0,0)
Pad_e246
  round 0.559 hole 0.336: 3(0,0)
Pad_e1335
  round 0.559 hole 0.355: 1(0,0)
Pad_e1345
  round 0.559 hole 0.355: 1(0,0)
Pad_e1348
  round 0.559 hole 0.355: 1(0,0)
Pad_e1349
  round 0.559 hole 0.355: 1(0,0)
Pad_e1362
  round 0.559 hole 0.355: 1(0,0)
Pad_e1363
  round 0.559 hole 0.355: 1(0,0)
Pad_e1364
  round 0.559 hole 0.355: 1(0,0)
Pad_e1365
  round 0.559 hole 0.355: 1(0,0)
Pad_e1379
  round 0.559 hole 0.355: 1(0,0)
Pad_e1382
  round 0.559 hole 0.355: 1(0,0)
Pad_e1387
  round 0.559 hole 0.355: 1(0,0)
Pad_e1388
  round 0.559 hole 0.355: 1(0,0)
Pad_e1414
  round 0.559 hole 0.355: 1(0,0)
Pad_e1415
  round 0.559 hole 0.355: 1(0,0)
Pad_e1677
  round 0.559 hole 0.336: 1(0,0)
Pad_e1680
  round 0.559 hole 0.336: 1(0,0)
Pad_e1681
  round 0.559 hole 0.336: 2(0,0)
Pad_e1682
  round 0.559 hole 0.336: 3(0,0)
Pad_e1683
  round 0.559 hole 0.336: 4(0,0)
Pad_e1684
  round 0.559 hole 0.336: 5(0,0)
Pad_e1685
  round 0.559 hole 0.336: 6(0,0)
Pad_e1686
  round 0.559 hole 0.336: 7(0,0)
Pad_e1687
  round 0.559 hole 0.336: 8(0,0)
Pad_e1688
  round 0.559 hole 0.336: 9(0,0)
Pad_e1694
  round 0.559 hole 0.336: 1(0,0)
Pad_e1707
  round 0.559 hole 0.336: 1(0,0)
Pad_e1711
  round 0.559 hole 0.336: 1(0,0)
Pad_e1712
  round 0.559 hole 0.336: 2(0,0)
Pad_e1713
  round 0.559 hole 0.336: 3(0,0)
Pad_e1714
  round 0.559 hole 0.336: 4(0,0)
Pad_e1716
  round 0.559 hole 0.336: 1(0,0)
Pad_e1717
  round 0.559 hole 0.336: 2(0,0)
Pad_e1718
  round 0.559 hole 0.336: 3(0,0)
Pad_e1719
  round 0.559 hole 0.336: 4(0,0)
Pad_e1720
  round 0.559 hole 0.336: 5(0,0)
Pad_e1721
  round 0.559 hole 0.336: 6(0,0)
Pad_e1722
  round 0.559 hole 0.336: 7(0,0)
Pad_e1723
  round 0.559 hole 0.336: 8(0,0)
Pad_e1724
  round 0.559 hole 0.336: 9(0,0)
Pad_e1725
  round 0.559 hole 0.336: 10(0,0)
Pad_e1726
  round 0.559 hole 0.336: 11(0,0)
Pad_e1727
  round 0.559 hole 0.336: 12(0,0)
Pad_e1728
  round 0.559 hole 0.336: 13(0,0)
Pad_e1731
  round 0.559 hole 0.336: 16(0,0)
Pad_e1732
  round 0.559 hole 0.336: 17(0,0)
Pad_e1733
  round 0.559 hole 0.336: 18(0,0)
Pad_e1734
  round 0.559 hole 0.336: 19(0,0)
Pad_e1735
  round 0.559 hole 0.336: 20(0,0)
Pad_e1736
  round 0.559 hole 0.336: 21(0,0)
Pad_e1742
  round 0.559 hole 0.336: 1(0,0)
Pad_e1745
  round 0.559 hole 0.336: 1(0,0)
Pad_e1746
  round 0.559 hole 0.336: 2(0,0)
Pad_e1747
  round 0.559 hole 0.336: 3(0,0)
R0603
  rect 0.806x0.864 smd: 1(-0.753,0) 2(0.753,0)
R0805
  rect 1.133x1.377 smd: 1(-1,0) 2(1,0)
SOT-23-3_L2.9-W1.3-P1.90-LS2.4-BR_1
  rect 1.25x0.7 smd: 1(1,-0.95) 2(1,0.95) 3(-1,0)
SOT-23-5_L2.9-W1.6-P0.95-LS2.8-BL
  rect 0.6x1 smd: 1(-0.95,-1.1) 2(0,-1.1) 3(0.95,-1.1) 4(0.95,1.1) 5(-0.95,1.1)
SOT-223-3_L6.5-W3.5-P3.05-LS7.0
  rect 2.5x1.1 smd: 1(2.97,-2.3) 2(2.97,0) 3(2.97,2.3)
  rect 2.34x3.6 smd: 4(-2.97,0)
TSSOP-24_L7.8-W4.4-P0.65-LS6.4-BL_1
  oval 0.364x1.71 smd: 1(-3.575,-2.78) 2(-2.925,-2.78) 3(-2.275,-2.78) 4(-1.625,-2.78) 5(-0.975,-2.78) 6(-0.325,-2.78) 7(0.325,-2.78) 8(0.975,-2.78) 9(1.625,-2.78) 10(2.275,-2.78) 11(2.925,-2.78) 12(3.575,-2.78) 13(3.575,2.78) 14(2.925,2.78) 15(2.275,2.78) 16(1.625,2.78) 17(0.975,2.78) 18(0.325,2.78) 19(-0.325,2.78) 20(-0.975,2.78) 21(-1.625,2.78) 22(-2.275,2.78) 23(-2.925,2.78) 24(-3.575,2.78)

## Nets
As in the schematic, except:
3V3_A: AD7172.7 AD7172.8 C3V3OUT10u.1 C3V3OUT100n.2 C_AVDD1.2 C_AVDD2.2 C_DEC_D_IR.1 C_DEC_D_R.1 FPC1.4 L2.2 NOREF.1 NOREF#15.1 NOREF#20.1 NOREF#29.1 NOREF#30.1 NOREF#35.1 NOREF#41.1 NOREF#49.1 OPA320_D_IR1.5 OPA320_D_R1.5
3V3_D: AD7172.16 C3V3IN10u.1 C3V3IN100n.2 C_IOVDD.1 CoutLDO.2 L2.1 NOREF#2.1 NOREF#9.1 NOREF#23.1 NOREF#42.1 NOREF#52.1 NOREF#53.1 REG.2 REG.4
GND: AD7172.2 AD7172.3 AD7172.6 AD7172.17 AD7172.22 AD7172.23 AD7172.24 C3V3IN10u.2 C3V3IN100n.1 C3V3OUT10u.2 C3V3OUT100n.1 C5VIN10u.2 C5VIN100n.1 C5VOUT10u.2 C5VOUT100n1.1 C_AL_AD.2 C_AVDD1.1 C_AVDD2.1 C_DEC_D_IR.2 C_DEC_D_R.2 C_IOVDD.2 C_REFOUT.2 C_REGCAPA_n.1 C_REGCAPA_u.1 C_REGCAPD.1 C_REGCAPD1.1 CinLDO.1 CoutLDO.1 ESP(12-19).3 ESP(20-29).4 ESP(20-29).10 FPC1.1 FPC1.3 FPC1.8 NOREF#3.6 NOREF#4.1 NOREF#5.9 NOREF#6.9 NOREF#7.11 NOREF#8.1 NOREF#10.3 NOREF#11.2 NOREF#12.1 NOREF#13.6 NOREF#14.3 NOREF#16.1 NOREF#17.19 NOREF#18.7 NOREF#19.16 NOREF#21.18 NOREF#22.20 NOREF#24.13 NOREF#25.3 NOREF#26.5 NOREF#27.2 NOREF#28.1 NOREF#31.3 NOREF#32.1 NOREF#33.7 NOREF#34.3 NOREF#36.8 NOREF#37.1 NOREF#38.10 NOREF#39.1 NOREF#40.3 NOREF#43.2 NOREF#44.17 NOREF#45.4 NOREF#46.4 NOREF#47.5 NOREF#48.12 NOREF#50.2 NOREF#51.8 NOREF#54.4 NOREF#55.21 OPA320_D_IR1.2 OPA320_D_R1.2 R_PULL_GPIO_IR.1 R_PULL_GPIO_R.1 R_SENSE_IR1.1 R_SENSE_R1.1 REG.1

Pads without a net: AD7172 1 9 10 15 19 20; ESP(1-10) 1 2 3 4 5 6 7 8; ESP(12-19) 1 2 4 5 6 7; ESP(20-29) 5 6 7 8; ESP(31-39) 1 2 3 4 5 6 7 8; FPC1 9 10

## Routing (per net, layer and track width the routed paths; a pad name or vN(x,y) marks a point on that pad's centre or on a via; arc(x,y) is an arc through that point)
3V3_A: length 166.2
  Top Layer w0.254: NOREF.1 NOREF#35.1 ; NOREF#41.1 53.34,14.35 62.43,14.35 L2.2 ; 59.88,33.23 59.23,32.58 57.53,32.58 54.48,29.53 54.48,28.19 53.09,26.8 NOREF#49.1 52.58,25.15 NOREF#29.1 ; 40.96,27.62 40.77,27.81 40.77,32.13 41.6,32.96 OPA320_D_R1.5 40.28,33.61 C_DEC_D_R.1 ; AD7172.8 AD7172.7 ; 41.66,26.92 NOREF#15.1 NOREF#30.1
  Top Layer w0.305: 45.08,55.33 45.3,55.33 45.3,54.52 ; C_AVDD2.2 45.08,54.74 45.3,54.52 ; 45.3,54.52 46.14,53.68 AD7172.8 ; 64.89,55.01 64.89,54.44 65.61,53.72 66.55,53.72 67.56,54.74 67.56,55.89 64.53,58.93 47.18,58.93 C_AVDD1.2 44.9,54.76
  Top Layer w0.508: 44.42,55.23 44.9,54.76 C_AVDD2.2 ; 44.42,55.23 44.42,54.13 44.45,54.1 45.21,54.1 ; 44.42,55.23 44.06,55.59 42.93,55.59 42.69,55.35 42.69,53.98 40.39,51.68 29.59,51.69 25.21,47.31 25.21,27.5 27.08,25.63 34.77,25.63 37.4,28.26 37.75,28.26 40.48,30.99 40.48,32.13 39.8,32.8 39.78,32.8 C_DEC_D_R.1 ; 64.96,10.85 64.96,10.25 ; 64.96,10.25 C3V3OUT100n.2 ; 64.96,10.25 65.49,10.78 65.49,10.85 67.49,10.85 C3V3OUT10u.1 ; 65.23,10.85 65.41,11.03 65.41,11.18 64.96,11.62
  Bottom Layer w0.254: NOREF#49.1 50.93,26.8 ; NOREF#20.1 41.66,26.92 ; NOREF#41.1 NOREF.1 ; NOREF#35.1 NOREF#29.1
3V3_D: length 73.8
  Top Layer w0.381: 49.66,23.11 49.66,22.57 CoutLDO.2 ; NOREF#52.1 49.66,24.76 53.59,28.7 NOREF#42.1 ; AD7172.16 45.49,46.25 45.08,45.85 44.26,45.85 43.37,44.96 47.69,40.64 50.04,40.64 NOREF#2.1
  Top Layer w0.508: NOREF#9.1 43.18,15.92 REG.2 REG.4 56.73,8.84 C3V3IN10u.1 62.1,10.79 62.66,11.35 62.66,12.19 ; CoutLDO.2 45.49,18.26 44.98,17.75 44.35,17.75 NOREF#23.1
  Top Layer w0.559: C3V3IN100n.2 62.66,9.38 62.66,10.37 62.53,10.37 62.1,10.79
  Top Layer w0.635: 62.66,11.6 62.74,11.53 62.74,10.79
  Bottom Layer w0.381: 53.59,35.57 53.59,37.08 NOREF#2.1 ; NOREF#53.1 NOREF#52.1
  Bottom Layer w0.508: 43.31,16.76 NOREF#23.1
5V: length 50
  Top Layer w0.254: 64.59,17.19 64.41,17.38 64.61,17.58 ; L1.2 64.59,17.6
  Top Layer w0.305: 64.39,55.01 64.39,54.35 72.9,45.85 72.9,22.87 C5VOUT10u.1
  Top Layer w0.508: C5VOUT10u.1 67.2,17.17 65.03,17.17 64.61,17.58 64.61,17.59 64.6,17.6 64.59,17.6 ; 64.9,16.89 64.59,17.19 64.59,16.11 C5VOUT100n1.2
5V_ESP32: length 76.3
  Top Layer w0.254: 62.44,16.07 62.33,15.95 C5VIN100n.2 ; 62.66,18.54 62.53,18.41 62.53,17.96 62.66,17.83
  Top Layer w0.508: 62.52,17.69 62.48,17.65 62.48,16.13 62.54,16.07 62.61,16.07 ; 62.52,17.69 62.3,17.91 C5VIN10u.1 58.68,17.79 57.66,16.76 44.32,16.76 42.69,18.4 CinLDO.2 41.96,14.85 REG.3 40.01,12.76 40.01,8.89 32.77,1.65 5.06,1.65 ESP(12-19).8 ; 62.52,17.69 62.66,17.83
GND: length 3
  Top Layer w0.254: 62.89,55.01 62.89,54.51 NOREF#39.1 ; 65.39,55.01 65.39,55.76 NOREF#8.1 ; 66.93,55.24 66.7,55.01 FPC1.1
CS: length 30.8
  Top Layer w0.254: 28.6,26.8 30,28.19 34.16,28.19 36.32,30.35 36.32,41.15 41.3,46.12 43.73,46.12 44.19,46.58 AD7172.14
D_IR: length 24.6
  Top Layer w0.305: BSS138IR.3 67.06,32.24 67.06,49.66 63.39,53.32 63.39,55.01
D_R: length 32.6
  Top Layer w0.305: 63.89,55.01 63.85,55.06 63.85,55.54 63.67,55.71 62.57,55.71 57.53,50.67 57.53,40.26 51.94,34.67 51.94,33.02 51.18,32.26 48.78,32.26 BSS138R.3
DAC_IR: length 74.6
  Top Layer w0.254: OPA320_D_IR1.3 61.8,31.02 R_PULL_GPIO_IR.2 61.8,27.83 57.52,23.56 3.11,23.56 0.89,25.78 0.89,27.43 2.79,29.34 ESP(1-10).9
DAC_R: length 44.8
  Top Layer w0.254: 3.2,26.8 4.45,26.8 6.1,25.15 39.23,25.15 R_PULL_GPIO_R.2 43.5,29.52 OPA320_D_R1.3
MISO: length 29.5
  Top Layer w0.254: ESP(20-29).3 32.13,31.88 34.04,33.78 34.04,41.91 44.19,52.07 AD7172.11
MOSI: length 17.3
  Top Layer w0.254: AD7172.12 38.86,48.13 29.61,48.13 ESP(20-29).9
SCLK: length 24.4
  Top Layer w0.254: AD7172.13 40.91,47.26 35.18,41.53 35.18,32.92 ESP(20-29).2
VOUT_TIA: length 16.4
  Top Layer w0.305: R_AL_AD.2 62.02,56.81 65.37,56.81 65.89,56.28 65.89,55.01
$1N2727: length 5.3
  Top Layer w0.254: AD7172.5 48.12,52.84 C_REGCAPA_u.2 50.56,55.63 C_REGCAPA_n.2
$1N2737: length 5.5
  Top Layer w0.254: AD7172.4 48.77,52.79 48.77,51.56 48.95,51.38 52.72,51.38 C_REFOUT.1
$1N2746: length 7.9
  Top Layer w0.254: AD7172.21 48.74,46.38 49.28,45.85 52.09,45.85 C_AL_AD.1 52.72,46.48 R_AL_AD.1
$1N2760: length 7.3
  Top Layer w0.254: OPA320_D_R1.4 46.56,33.61 R_SENSE_R1.2 50.37,33.62 BSS138R.2
$1N2763: length 3.4
  Top Layer w0.254: BSS138R.1 50.22,31.43 R_G_R.2
$1N2768: length 9.1
  Top Layer w0.254: 61.78,33.23 64.29,33.23 R_SENSE_IR1.2 64.9,32.31 66.09,31.11 67.44,31.11 68.82,32.5 BSS138IR.2
$1N2770: length 2.9
  Top Layer w0.254: R_G_IR.2 68.82,30.09 BSS138IR.1
$1N2775: length 7.9
  Top Layer w0.254: R_G_R.1 45.85,29.34 45.08,30.1 45.08,31.55 44.32,32.31 41.84,32.31 41.66,32.13 41.66,31.47 OPA320_D_R1.1
$1N2776: length 9.4
  Top Layer w0.254: R_G_IR.1 65.87,28.65 63.43,28.65 62.99,29.08 62.99,31.11 62.18,31.93 60.12,31.93 59.94,31.75 59.94,31.09 59.88,31.03
$1N2779: length 5.2
  Top Layer w0.254: C_REGCAPD1.2 C_REGCAPD.2 46.79,45.65 AD7172.18

## Copper pours and planes (outline as drawn; the poured copper is in the pictures)
GND on Bottom Layer: 0.13,60.2 77.09,60.2 77.09,0.13 0.13,0.13

## Text on the board
Bottom Silkscreen Layer: DESENVOLUPAMENT DE PROJECTES / D'ELECTRONICA 2026 | LLUIS FRANCESC COLLELL i / MAR STEINHAUER | Main board | NEAR INFRARED SPECTROSCOPY
Top Silkscreen Layer: DRIVER_R | 5 TO 3V3 | A/D CONVERTER | DRIVER_IR | FILTRE PI | ESP32 Dev Kit C V5
